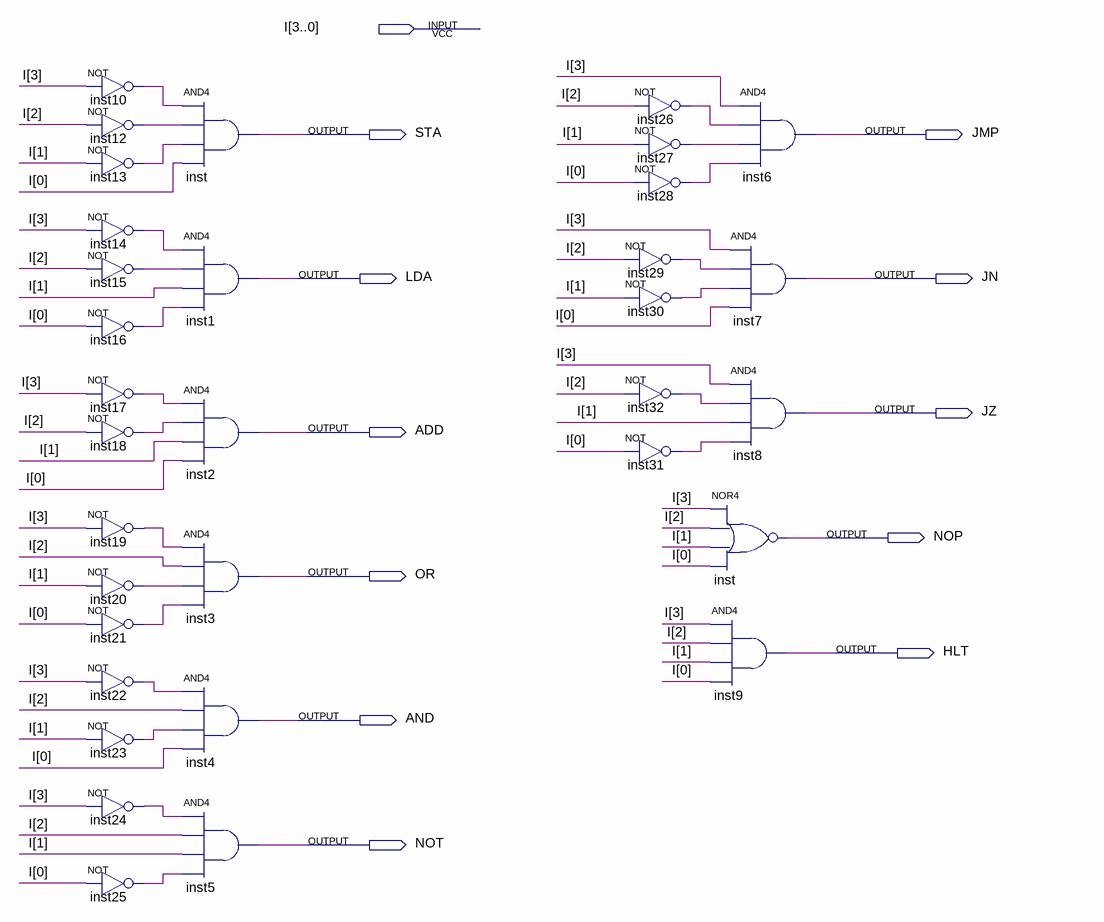
[diagram p0: schematic sheet]
// Quartus schematic decoder.bdf as structural Verilog: 33 symbols, 12 pins
module decoder (
  input  [3:0] I,
  output STA,
  output JMP,
  output LDA,
  output JN,
  output JZ,
  output ADD,
  output NOP,
  output OR,
  output HLT,
  output AND,
  output NOT
);

  wire inst10_out, inst12_out, inst13_out, inst14_out, inst15_out, inst16_out, inst17_out, inst18_out,
       inst19_out, inst20_out, inst21_out, inst22_out, inst23_out, inst24_out, inst25_out, inst26_out,
       inst27_out, inst28_out, inst29_out, inst30_out, inst31_out, inst32_out;

  not inst10 (inst10_out, I[3]);
  not inst12 (inst12_out, I[2]);
  not inst13 (inst13_out, I[1]);
  not inst14 (inst14_out, I[3]);
  not inst15 (inst15_out, I[2]);
  not inst16 (inst16_out, I[0]);
  not inst17 (inst17_out, I[3]);
  not inst18 (inst18_out, I[2]);
  not inst19 (inst19_out, I[3]);
  not inst20 (inst20_out, I[1]);
  not inst21 (inst21_out, I[0]);
  not inst22 (inst22_out, I[3]);
  not inst23 (inst23_out, I[1]);
  not inst24 (inst24_out, I[3]);
  not inst25 (inst25_out, I[0]);
  and inst (STA, inst10_out, inst12_out, inst13_out, I[0]);
  and inst1 (LDA, inst14_out, inst15_out, I[1], inst16_out);
  and inst2 (ADD, inst17_out, inst18_out, I[1], I[0]);
  and inst3 (OR, inst19_out, I[2], inst20_out, inst21_out);
  and inst4 (AND, inst22_out, I[2], inst23_out, I[0]);
  and inst5 (NOT, inst24_out, I[2], I[1], inst25_out);
  not inst29 (inst29_out, I[2]);
  not inst30 (inst30_out, I[1]);
  not inst32 (inst32_out, I[2]);
  not inst31 (inst31_out, I[0]);
  not inst26 (inst26_out, I[2]);
  not inst27 (inst27_out, I[1]);
  not inst28 (inst28_out, I[0]);
  and inst6 (JMP, I[3], inst26_out, inst27_out, inst28_out);
  and inst7 (JN, I[3], inst29_out, inst30_out, I[0]);
  and inst8 (JZ, I[3], inst32_out, I[1], inst31_out);
  nor inst_dup2 (NOP, I[3], I[2], I[1], I[0]);
  and inst9 (HLT, I[3], I[2], I[1], I[0]);
endmodule
